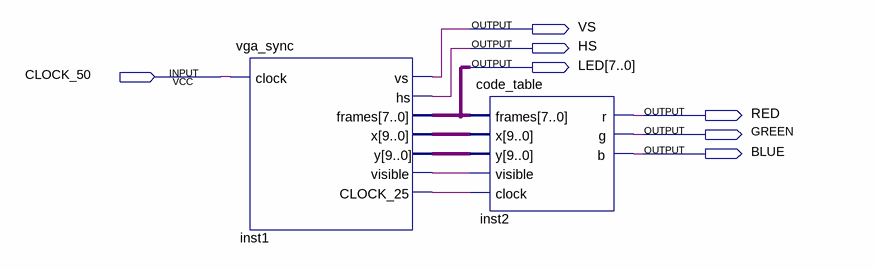
[diagram p0: schematic sheet]
// Quartus schematic VGA.bdf as structural Verilog: 2 symbols, 7 pins
module VGA (
  input  CLOCK_50,
  output VS,
  output HS,
  output [7:0] LED,
  output RED,
  output GREEN,
  output BLUE
);

  wire inst1_clock_25, inst1_visible;
  wire [9:0] inst1_x, inst1_y;

  vga_sync inst1 (
    .clock(CLOCK_50), .vs(VS), .hs(HS), .frames(LED), .x(inst1_x), .y(inst1_y), .visible(inst1_visible),
    .CLOCK_25(inst1_clock_25));
  code_table inst2 (
    .frames(LED), .x(inst1_x), .y(inst1_y), .visible(inst1_visible), .clock(inst1_clock_25), .r(RED),
    .g(GREEN), .b(BLUE));
endmodule
